# EAGLE design tiny1624 (EAGLE 7.1.0)
DATABASE: ./../../../EAGLE/PARTSDB.TXT
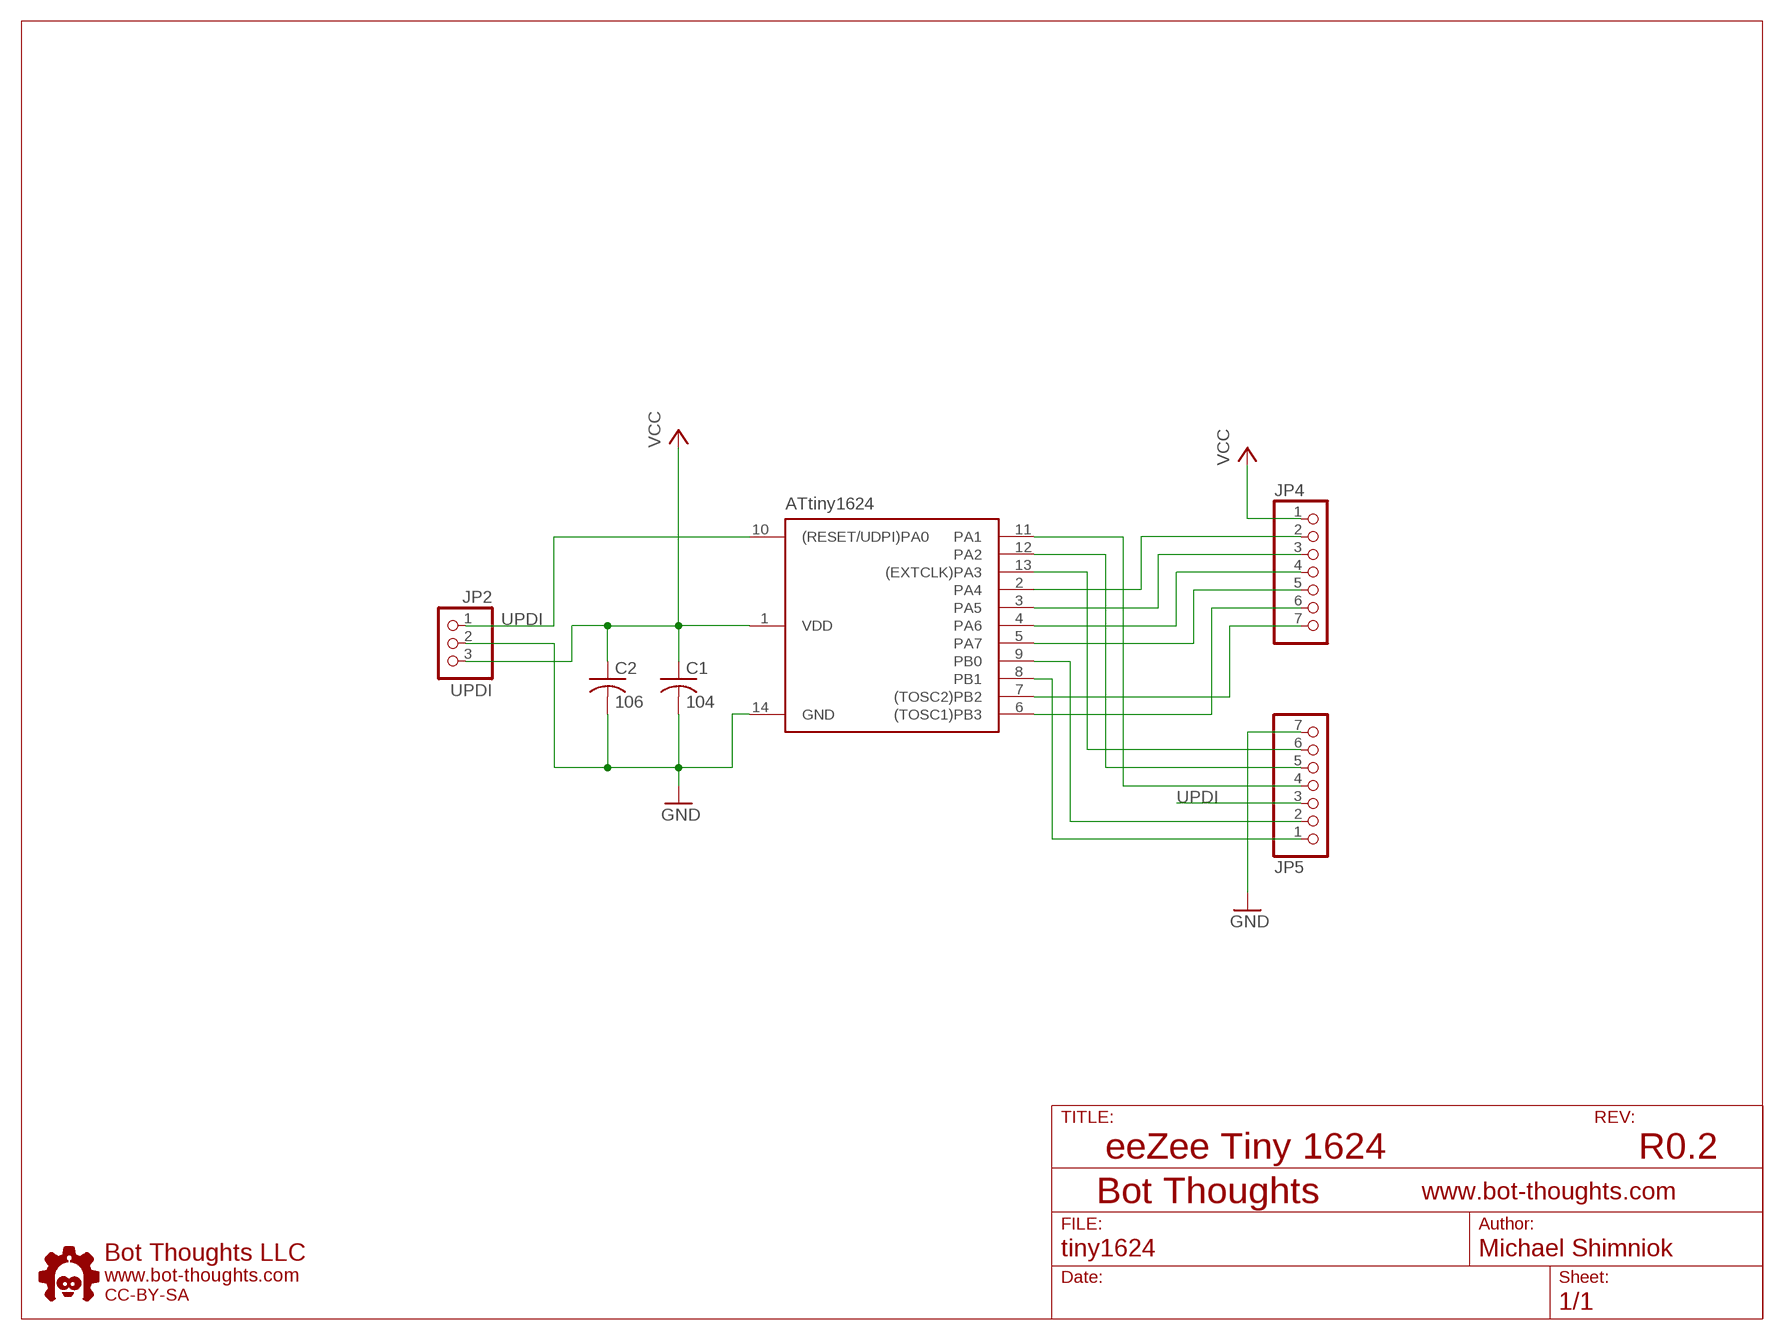
[diagram p0: schematic, sheet 1]

## Parts
C1  104  C-USC0603  [C0603]
C2  106  C-1206  [1206]
JP2  UPDI  PINHD-1X03_2.54-S  [1X03-S]
JP4  PINHD-1X07_2.54-S  [1X07-S]
JP5  PINHD-1X07_2.54-S  [1X07-S]
U1  ATTINY1624  ATTINY1624-SSU  [SOIC14N]
U$1  BTLOGO-LOGO-MD  [BTLOGOM]

## Nets
GND: C1.2 C2.2(-) JP2.2 JP5.7 U1.14(GND)
N$1: JP4.2 U1.2(PA4)
N$2: JP4.3 U1.3(PA5)
N$3: JP4.4 U1.4(PA6)
N$4: JP4.5 U1.5(PA7)
N$5: JP4.6 U1.6((TOSC1)PB3)
N$6: JP4.7 U1.7((TOSC2)PB2)
N$7: JP5.1 U1.8(PB1)
N$8: JP5.2 U1.9(PB0)
N$9: JP5.4 U1.11(PA1)
N$10: JP5.5 U1.12(PA2)
N$11: JP5.6 U1.13((EXTCLK)PA3)
UPDI: JP2.1 JP5.3 U1.10((RESET/UDPI)PA0)
VCC: C1.1 C2.1(+) JP2.3 JP4.1 U1.1(VDD)

## Notes on the sheet
- eeZee Tiny 1624 | R0.2

## Library data of the parts
C1 = rcl:C-US: CAPACITOR, American symbol; BOM: EXCLUDE; PARTNO: 0603YC104KAT2A
C2 = bt_rcl:C: Capacitor, non-polarized, American symbol; BOM: EXCLUDE; PARTNO: MCTT21X106M6R3CT
JP2 = pinhead-2:PINHD-1X03: PIN HEADER
JP4 JP5 = pinhead-2:PINHD-1X07: PIN HEADER
U1 = bt_avr:ATTINY1624: ATtiny1624 The ATtiny1624 microcontrollers of the tinyAVR ® 2 family use the AVR ® CPU with hardware multiplier, running at up to 20 MHz, with 16 KB Flash, 2 KB of SRAM, and 256B of EEPROM available in a 14-pin package. The family uses the latest technologies from Microchip with a flexible and low-power architecture, including Event System, advanced digital peripherals, and accurate analog features such as a 12-bit differential ADC with Programmable Gain Amplifier (PGA). datasheet.pdf <https://ww1.microchip.com/downloads/en/DeviceDoc/ATtiny1624-26-27-DataSheet-DS40002234A.pdf>
U$1 = bt:BTLOGO: Bot Thoughts Logo

## Board
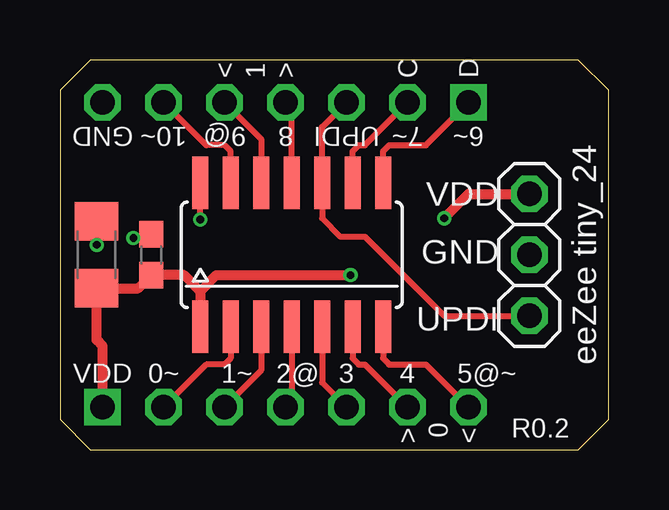
[diagram p1: board, top side]
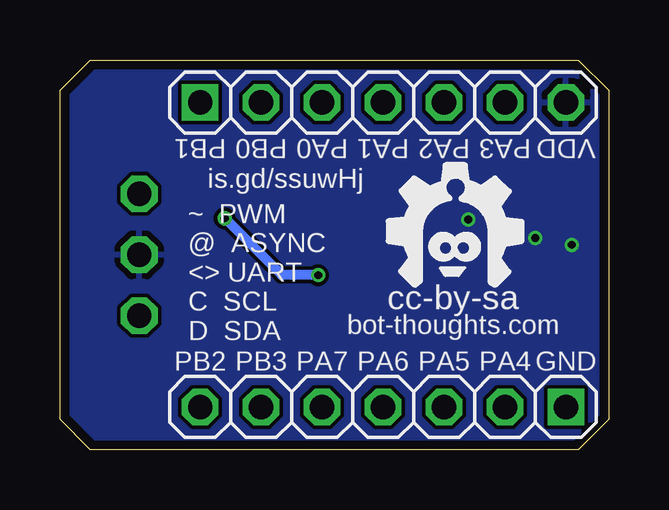
[diagram p2: board, bottom side, seen from below]

Size 22.86 x 16.26 mm. Coordinates in mm from the lower left corner, seen from the top.
Outline: 0,14.99 0,1.27 1.27,0 21.59,0 22.86,1.27 22.86,14.99 21.59,16.26 1.27,16.26 0,14.99
Copper layers (1*16): Top 0.035559375mm / dielectric 1.6mm / Bottom 0.035559375mm
Design rules "oshpark-2layer": minimum track width 6mil, minimum drill 10mil, track to track 6mil, track to pad 6mil, pad to pad 6mil, via to via 6mil, smd to smd 0mil, copper to edge 15mil, drill to drill 6mil, minimum pad ring 5mil, minimum via ring 5mil, stop-mask expansion 2.5mil, vias tented up to drill 0mil, thermal gap 10mil

### Footprints (pad centres in the part's own frame; a part is rotated, then mirrored left to right if it is on the bottom)
C0603 = smd 1.1 x 1: 1 -0.85,0; 2 0.85,0
1206 = smd 1.6 x 1.8: 1 -1.4,0; 2 1.4,0
1X03-S = drill 1.016 octagon: 1 -2.54,0; 2 0,0; 3 2.54,0
1X07-S = drill 1.016 square: 1 -7.62,0 | drill 1.016 octagon: 2 -5.08,0; 3 -2.54,0; 4 0,0; 5 2.54,0; 6 5.08,0; 7 7.62,0
SOIC14N = smd 0.66 x 2.2: 1 -3.81,-3; 2 -2.54,-3; 3 -1.27,-3; 4 0,-3; 5 1.27,-3; 6 2.54,-3; 7 3.81,-3; 8 3.81,3; 9 2.54,3; 10 1.27,3; 11 0,3; 12 -1.27,3; 13 -2.54,3; 14 -3.81,3

### Placement (x,y rotation side)
C1  3.81,8.13 90 top
C2  1.52,8.13 90 top
JP2  19.56,8.13 90 top
JP4  9.4,1.78 180 bottom
JP5  9.4,14.48 0 bottom
U1  9.65,8.13 0 top
U$1  6.48,6.6 0 bottom

### Tracks (layer width: path | path; a pad name or v marks a point on that pad's centre or on a via)
GND  (via drill 0.33)
  Top 0.254: C2.2 v1.54,8.55 | C1.2 3.68,8.76 3.37,8.83 v3.06,8.83 | v5.84,9.6 U1.14 5.84,11.18
  pour Bottom: 0,16.26 22.86,16.26 22.86,0 0,0
N$1
  Top 0.254: U1.2 7.11,3.81 6.86,3.56 6.1,3.56 JP4.2
N$2
  Top 0.254: U1.3 8.38,3.3 JP4.3
N$3
  Top 0.254: U1.4 9.65,2.03 JP4.4
N$4
  Top 0.254: U1.5 10.92,2.79 JP4.5
N$5
  Top 0.254: U1.6 12.19,3.81 12.45,3.56 12.7,3.56 JP4.6
N$6
  Top 0.254: U1.7 13.46,3.81 13.72,3.56 15.24,3.56 JP4.7
N$7
  Top 0.254: U1.8 13.46,12.45 13.72,12.7 15.24,12.7 JP5.1
N$8
  Top 0.254: U1.9 12.19,12.45 12.45,12.7 12.7,12.7 JP5.2
N$9
  Top 0.254: U1.11 9.65,14.22 JP5.4
N$10
  Top 0.254: JP5.5 8.38,12.95 U1.12
N$11
  Top 0.254: U1.13 7.11,12.45 6.86,12.7 6.1,12.7 JP5.6
UPDI
  Top 0.254: JP5.3 10.92,13.46 U1.10 10.92,9.65 11.68,8.89 12.7,8.89 16,5.59 JP2.1
VCC  (via drill 0.33)
  Top 0.406: JP4.1 1.78,4.32 1.52,4.57 C2.1 3.26,6.73 C1.1 5.17,7.28 5.84,6.6 | 5.84,6.6 6.52,7.28 v12.1,7.28 | v16,9.65 17.02,10.67 JP2.3 | 5.84,6.6 U1.1
  Bottom 0.406: v12.1,7.28 13.63,7.28 v16,9.65

### Text on the board
tNames: < | 1 | > | C | D | GND | 10~ | 9@ | 8 | UPDI | 7~ | 6~ | VDD | GND | eeZee tiny_24 | VDD | 0~ | 1~ | 2@ | 3 | 4 | 5@~ | 0 | R0.2 | > | <
bNames: VDD | PA3 | PA2 | PA1 | PA0 | PB0 | PB1 | is.gd/ssuwHj | cc-by-sa | bot-thoughts.com | ~ PWM / @ ASYNC / <> UART / C SCL / D SDA | GND | PA4 | PA5 | PA6 | PA7 | PB3 | PB2
tsilk: PA0 | PA1 | PA2 | PA3 | PA4 | PA5 | GND | Rev 0.1A | ATtiny841 | reset | VCC | eeZeeTiny841 | PB0 | PB1 | PB3 | PB2 | PA7 | PA6
bsilk: bot-thoughts.com